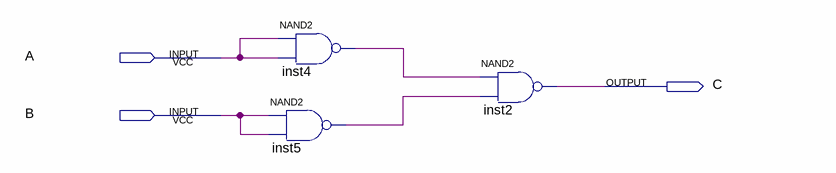
[diagram p0: schematic sheet]
// Quartus schematic Block11.bdf as structural Verilog: 3 symbols, 3 pins
module Block11 (
  input  A,
  input  B,
  output C
);

  wire inst4_out, inst5_out;

  nand inst5 (inst5_out, B, B);
  nand inst4 (inst4_out, A, A);
  nand inst2 (C, inst4_out, inst5_out);
endmodule
